# Altium schematic sheet 海关全向本体电路板V3_数图传通信.SchDoc
size A4
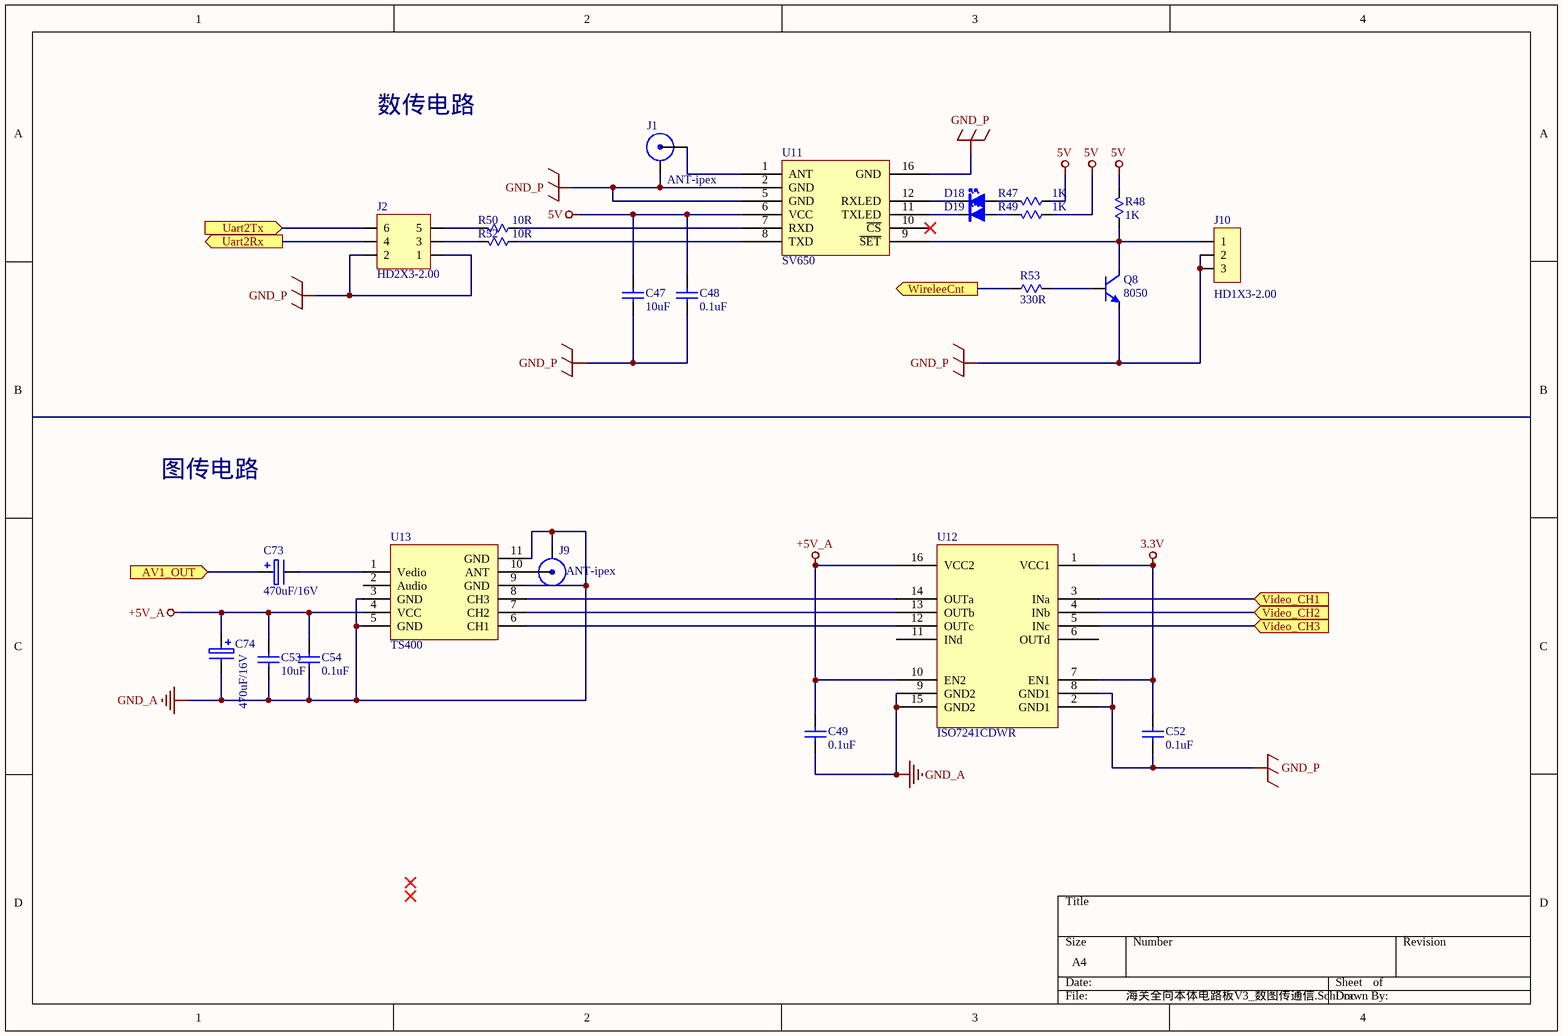
[diagram p0: 海关全向本体电路板V3_数图传通信.SchDoc]

## Parts
C47  10uF  [C0603-S]
C48  0.1uF  [C0603-S]
C49  0.1uF  [C0603-S]
C52  0.1uF  [C0603-S]
C53  10uF  [C0603-S]
C54  0.1uF  [C0603-S]
C73  470uF/16V  [CAPPR-8X10-SM]
C74  470uF/16V  [CAPPR-8X10-SM]
D18  LED  [LED0603]  (value not drawn)
D19  LED  [LED0603]  (value not drawn)
J1  ANT-ipex  [SMJB-5.00]
J2  HD2X3-2.00  [HD2X3-2.00]
J9  ANT-ipex  [SMJB-5.00]
J10  HD1X3-2.00  [HD1X3-2.00]
Q8  8050  [SOT-23]
R47  1K  [R0603-S]
R48  1K  [R0603-S]
R49  1K  [R0603-S]
R50  10R  [R0603-S]
R52  10R  [R0603-S]
R53  330R  [R0603-S]
U11  SV650  [SV650]
U12  ISO7241CDWR  [SO16-290]
U13  TS400  [TS400]

## Ports
AV1_OUT (in), Uart2Rx (out), Uart2Tx (in), Video_CH1 (in), Video_CH2 (in), Video_CH3 (in), WireleeCnt (out)

## Nets
3.3V: C52.2 U12.1(VCC1) U12.7(EN1)
5V: C47.2 C48.2 R47.1 R48.1 R49.1 U11.6(VCC)
+5V_A: C49.2 C53.2 C54.2 C74.1 U12.10(EN2) U12.16(VCC2) U13.4(VCC)
GND_A: C49.1 C53.1 C54.1 C74.2 J9.2(GND) U12.9(GND2) U12.15(GND2) U13.3(GND) U13.5(GND) U13.9(GND) U13.11(GND)
GND_P: C47.1 C48.1 C52.1 J1.2(GND) J2.1 J2.2 J10.2 J10.3 Q8.2(E) U11.2(GND) U11.5(GND) U11.16(GND) U12.2(GND1) U12.8(GND1)
AV1_OUT: C73.1 ; port AV1_OUT
Uart2Rx: J2.4 ; port Uart2Rx
Uart2Tx: J2.6 ; port Uart2Tx
Video_CH1: U12.3(INa) ; port Video_CH1
Video_CH2: U12.4(INb) ; port Video_CH2
Video_CH3: U12.5(INc) ; port Video_CH3
WireleeCnt: R53.2 ; port WireleeCnt
NetC73_2: C73.2 U13.1(Vedio)
NetD18_1: D18.1(A) R47.2
NetD18_2: D18.2(K) U11.12(RXLED)
NetD19_1: D19.1(A) R49.2
NetD19_2: D19.2(K) U11.11(TXLED)
NetJ1_1: J1.1(ANT) U11.1(ANT)
NetJ2_3: J2.3 R52.2
NetJ2_5: J2.5 R50.2
NetJ9_1: J9.1(ANT) U13.10(ANT)
NetJ10_1: J10.1 Q8.3(C) R48.2 U11.9(~{SET})
NetQ8_1: Q8.1(B) R53.1
NetR50_1: R50.1 U11.7(RXD)
NetR52_1: R52.1 U11.8(TXD)
NetU12_12: U12.12(OUTc) U13.6(CH1)
NetU12_13: U12.13(OUTb) U13.7(CH2)
NetU12_14: U12.14(OUTa) U13.8(CH3)

Not connected (* = marked no-connect by the designer): U11 10(~{CS})*; U12 6(OUTd) 11(INd); U13 2(Audio)

## Notes on the sheet
- 数传电路
- 图传电路

## Library data of the parts
C47-C49 C52-C54 = Cap Semi
C73 C74 = ELECTRO: Electrolytic Capacitor
J2 = HEADER2X3-2.0
J10 = HEADER1X3
Q8 = NPN: NPN General Purpose Amplifier; Published: 8-Jun-2000; LatestRevisionDate: 15-Jan-2003; LatestRevisionNote: PCB Footprint 'BCY-W3/D4.7' replaced; DatasheetDocument: 1997; PackageDocument: Sep-1998; PackageReference: TO-92A; Publisher: Altium Limited; Code_JEDEC: TO-92A; ComponentLink1Description: Manufacturer Link; ComponentLink1URL: http://www.fairchildsemi.com/; ComponentLink2Description: Datasheet; ComponentLink2URL: http://www.fairchildsemi.com/ds/2N%2F2N3904.pdf
R47 R49 R50 R52 = Res: Resistor; Published: 8-Jun-2000; LatestRevisionDate: 04-Mar-2005; LatestRevisionNote: PCB Footprint replaced.; PackageReference: J1-0603; Publisher: Altium Limited
R48 R53 = RES: Resistor; Published: 8-Jun-2000; LatestRevisionDate: 17-Jul-2002; LatestRevisionNote: Re-released for DXP Platform.; PackageReference: AXIAL-0.3; Publisher: Altium Limited
  R48: Value: 1K
  R53: Value: 330R
U12 = ISO7241A: Octal bus transceiver and 3.3V to 5V shifter with 3-state outputs